# Altium schematic sheet yard-ice-change-log.SchDoc: Yard-Ice-Power
size 365 x 274 mm; Revision: 1.0; SheetNumber: 2; SheetTotal: 5
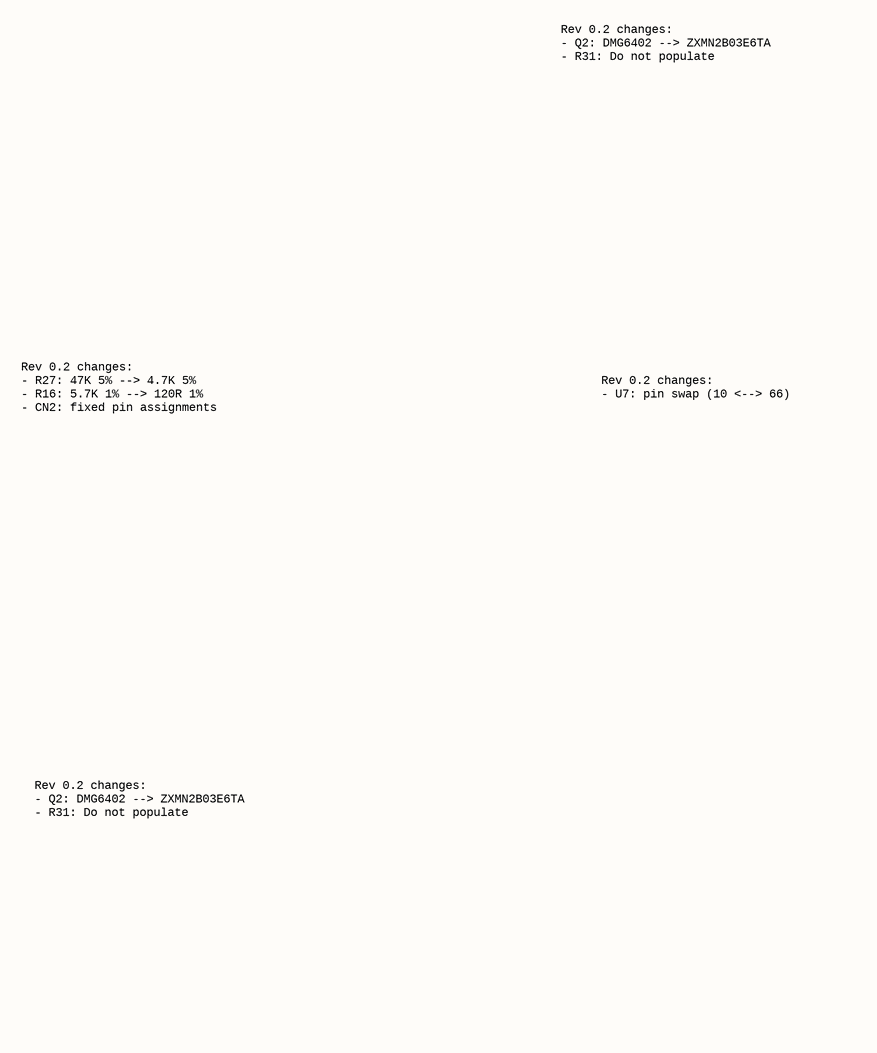
[diagram p0: yard-ice-change-log.SchDoc]

## Notes on the sheet
- Rev 0.2 changes:
  - Q2: DMG6402 --> ZXMN2B03E6TA
  - R31: Do not populate
- Rev 0.2 changes:
  - R27: 47K 5% --> 4.7K 5%
  - R16: 5.7K 1% --> 120R 1%
  - CN2: fixed pin assignments
- Rev 0.2 changes:
  - U7: pin swap (10 <--> 66)
- TITLE
- CHK
- DWN
- APV
- DWG
- REV
- File:
- Sheet
- of